# EAGLE design snes_sd_cart (EAGLE 9.6.2)
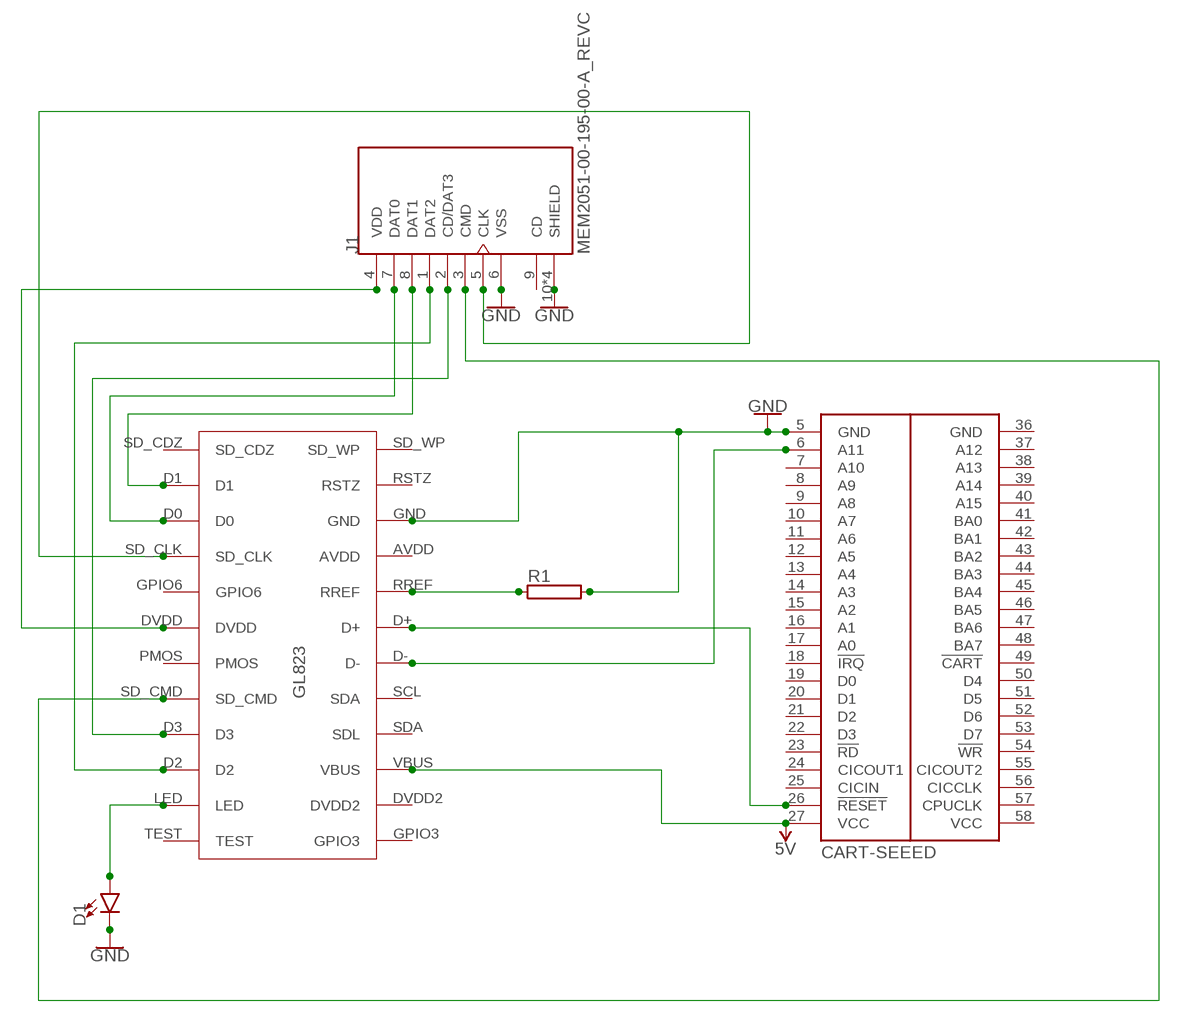
[diagram p0: schematic, sheet 1]

## Parts
D1  LED-3MM-NO_SILK  [LED_3MM-NS]
J1  MEM2051-00-195-00-A_REVC  [GCT_MEM2051-00-195-00-A_REVC]
R1  RAC01  [AC01]
U$1  CART-SEEED  [CART-50MM]
U$2  GL823  [GL823]

## Nets
5V: U$1.27(VCC) U$2.VBUS
GND: D1.K(C) J1.6(VSS) J1.10(SHIELD) J1.11(SHIELD) J1.12(SHIELD) J1.13(SHIELD) R1.2 U$1.5(GND) U$2.GND
N$1: J1.7(DAT0) U$2.D0
N$2: J1.8(DAT1) U$2.D1
N$3: J1.1(DAT2) U$2.D2
N$4: J1.2(CD/DAT3) U$2.D3
N$5: J1.3(CMD) U$2.SD_CMD
N$6: J1.5(CLK) U$2.SD_CLK
N$7: R1.1 U$2.RREF
N$8: J1.4(VDD) U$2.DVDD
N$9: U$1.26(!RESET) U$2.D+
N$10: U$1.6(A11) U$2.D-
N$11: D1.A U$2.LED
Unconnected: J1.9(CD) U$1.7(A10) U$1.8(A9) U$1.9(A8) U$1.10(A7) U$1.11(A6) U$1.12(A5) U$1.13(A4) U$1.14(A3) U$1.15(A2) U$1.16(A1) U$1.17(A0) U$1.18(!IRQ) U$1.19(D0) U$1.20(D1) U$1.21(D2) U$1.22(D3) U$1.23(!RD) U$1.24(CICOUT1) U$1.25(CICIN) U$1.37(A12) U$1.38(A13) U$1.39(A14) U$1.40(A15) U$1.41(BA0) U$1.42(BA1) U$1.43(BA2) U$1.44(BA3) U$1.45(BA4) U$1.46(BA5) U$1.47(BA6) U$1.48(BA7) U$1.49(!CART) U$1.50(D4) U$1.51(D5) U$1.52(D6) U$1.53(D7) U$1.54(!WR) U$1.55(CICOUT2) U$1.56(CICCLK) U$1.57(CPUCLK) U$2.AVDD U$2.DVDD2 U$2.GPIO3 U$2.GPIO6 U$2.PMOS U$2.RSTZ U$2.SCL(SDA) U$2.SD_CDZ U$2.SD_WP U$2.SDA(SDL) U$2.TEST

## Power pins joined to a net without a drawn wire
GND: U$1.36(GND)
VCC: U$1.58(VCC)

## Library data of the parts
D1 = SparkFun-LED:LED: LED (Generic) Standard schematic elements and footprints for 5mm, 3mm, 1206, and 0603 sized LEDs. Generic LEDs with no color specified.
J1 = MEM2051-00-195-00-A_REVC:MEM2051-00-195-00-A_REVC: Micro SD Memory Card Connector, 1.88mm Profile SMT,Push Push, with normally closed switch Check prices <https://snapeda.com/parts/MEM2051-00-195-00-A/Global%20Connector%20Technology/view-part/?ref=eda> Check prices <https://pricing.snapeda.com/parts/MEM2051-00-195-00-A/Global%20Connector%20Technology/view-part?ref=eda>; AVAILABILITY: Warning; DESCRIPTION: 9 (8 + 1) Position Card Connector microSD Surface Mount, Right Angle Gold, 1.95mm profile, Normally open switch, Push push, Top mount; MF: Global Connector Technology; MP: MEM2051-00-195-00-A; PACKAGE: None; PRICE: None
R1 = resistor-power:R: Power Resitor; OC_FARNELL: unknown; OC_NEWARK: unknown
U$1 = snes_cart:CART: Standard 46-contact SNES cartridge edge connector
U$2 = untitled:GL823

## Board
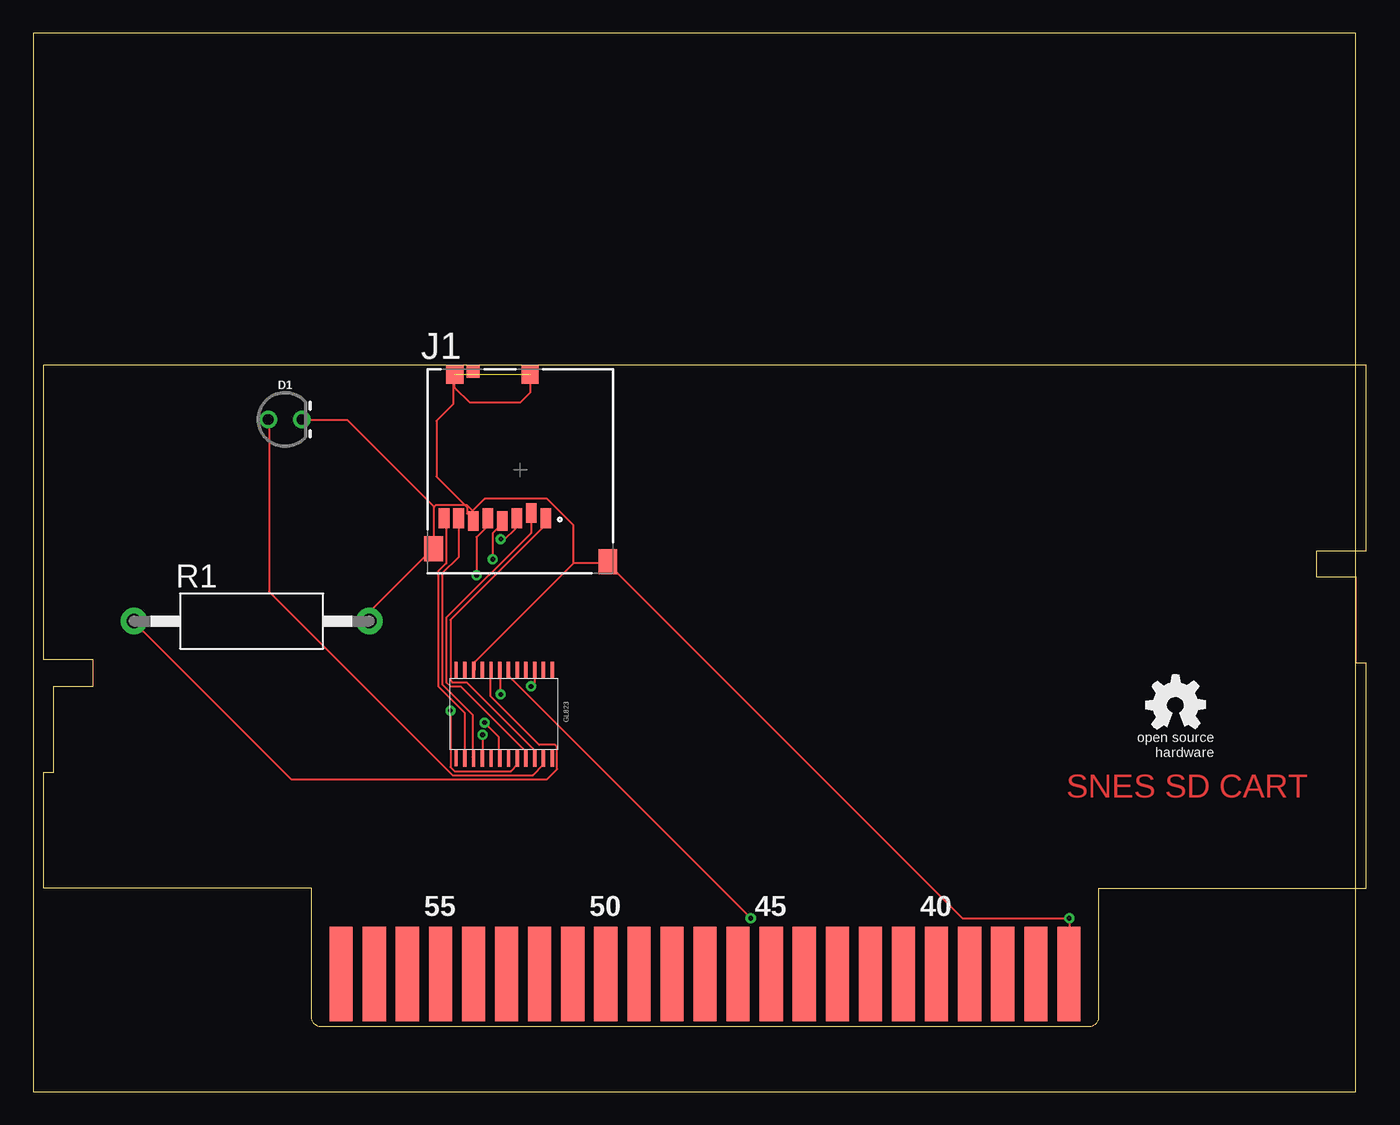
[diagram p1: board, top side]
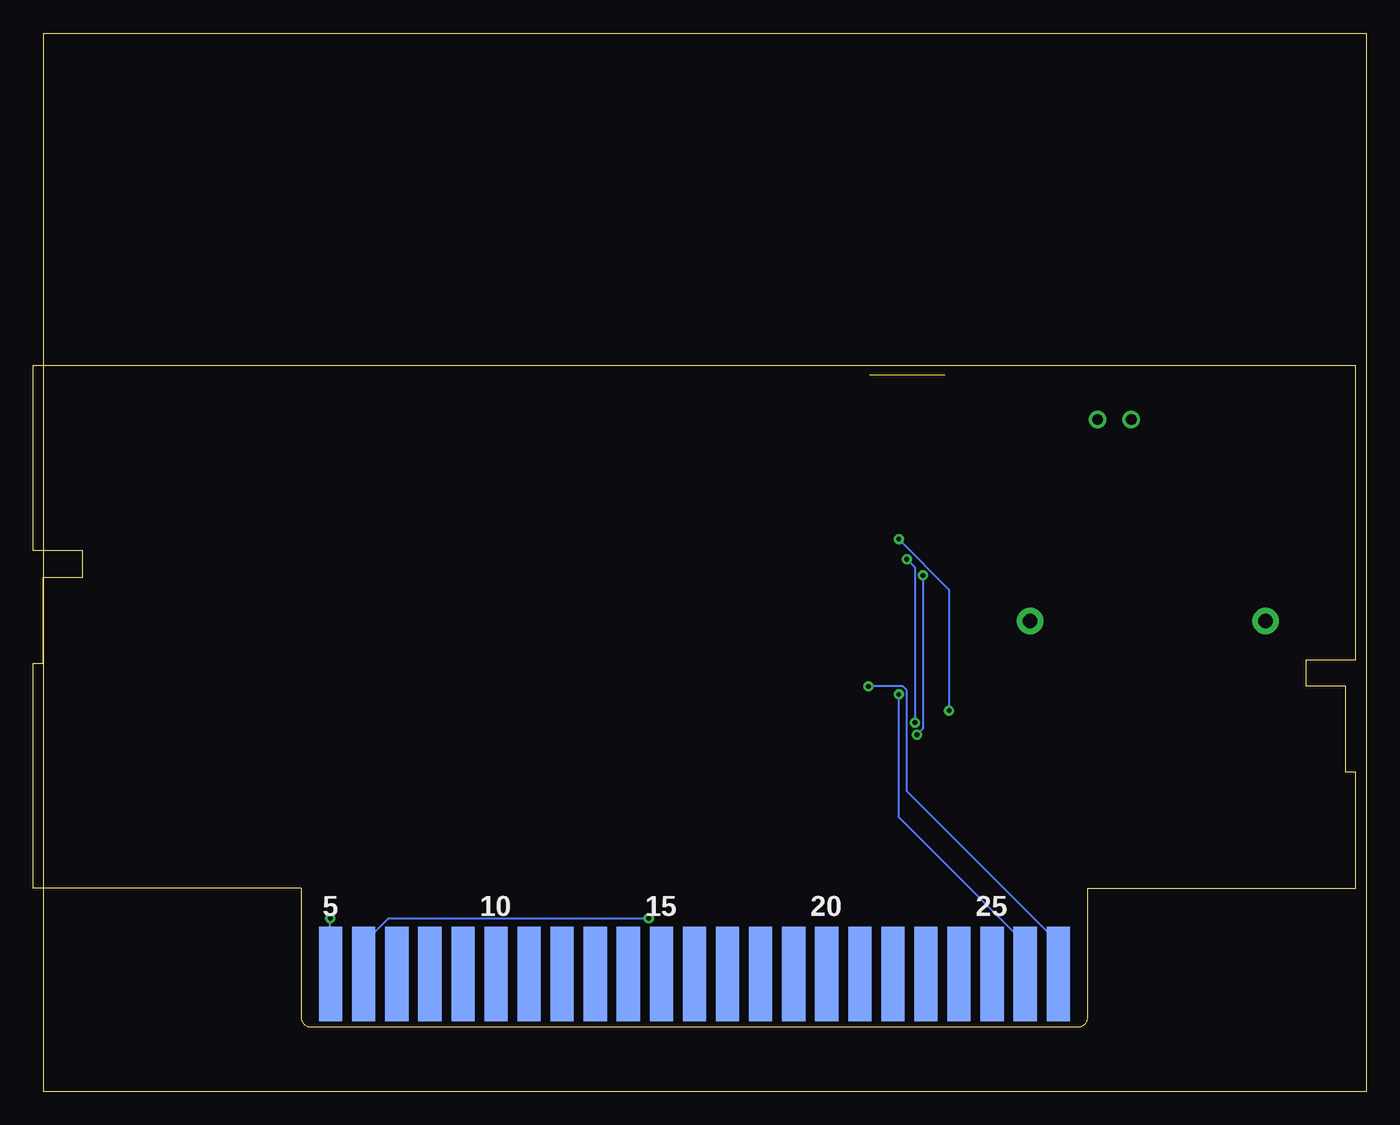
[diagram p2: board, bottom side, seen from below]

Size 100 x 80 mm. Coordinates in mm from the lower left corner, seen from the top.
Outline: 0,0 100,0 100,80 0,80 0,0
Copper layers (1*16): Top 0.035mm / dielectric 1.5mm / Bottom 0.035mm
Design rules "default": minimum track width 6mil, minimum drill 0.35mm, track to track 6mil, track to pad 6mil, pad to pad 6mil, via to via 6mil, smd to smd 6mil, copper to edge 40mil, drill to drill 6mil, minimum pad ring 10mil, minimum via ring 8mil, stop-mask expansion 4mil, vias tented up to drill 0mil, thermal gap 10mil

### Footprints (pad centres in the part's own frame; a part is rotated, then mirrored left to right if it is on the bottom)
LED_3MM-NS = drill 0.813: A -1.27,0; K 1.27,0
GCT_MEM2051-00-195-00-A_REVC = smd 0.8 x 1.5: 1 1.94,-3.66; 2 0.84,-3.26; 3 -0.26,-3.66; 4 -1.36,-3.86; 5 -2.46,-3.66; 6 -3.56,-3.86; 7 -4.66,-3.66; 8 -5.76,-3.66 | smd 1 x 0.95: 9 -3.56,7.425 | smd 1.3 x 1.4: 10 -4.95,7.2; 11 0.75,7.2 | smd 1.4 x 1.9: 12 -6.55,-5.95; 13 6.6,-6.95
AC01 = drill 1.1 pad 2: 1 -8.9,0; 2 8.9,0
CART-50MM = smd 1.75 x 7.15 bottom: 5 27.5,0; 6 25,0; 7 22.5,0; 8 20,0; 9 17.5,0; 10 15,0; 11 12.5,0; 12 10,0; 13 7.5,0; 14 5,0; 15 2.5,0; 16 0,0; 17 -2.5,0; 18 -5,0; 19 -7.5,0; 20 -10,0; 21 -12.5,0; 22 -15,0; 23 -17.5,0; 24 -20,0; 25 -22.5,0; 26 -25,0; 27 -27.5,0 | smd 1.75 x 7.15: 36 27.5,0; 37 25,0; 38 22.5,0; 39 20,0; 40 17.5,0; 41 15,0; 42 12.5,0; 43 10,0; 44 7.5,0; 45 5,0; 46 2.5,0; 47 0,0; 48 -2.5,0; 49 -5,0; 50 -7.5,0; 51 -10,0; 52 -12.5,0; 53 -15,0; 54 -17.5,0; 55 -20,0; 56 -22.5,0; 57 -25,0; 58 -27.5,0
GL823 = smd 0.254 x 1.245: AVDD -1.6,2.642; D0 -2.261,-3.988; D1 -2.921,-3.988; D2 2.362,-3.988; D3 1.702,-3.988; D+ -0.279,2.642; D- 0.381,2.642; DVDD -0.279,-3.988; DVDD2 3.023,2.642; GND -2.261,2.642; GPIO3 3.683,2.642; GPIO6 -0.94,-3.988; LED 3.023,-3.988; PMOS 0.381,-3.988; RREF -0.94,2.642; RSTZ -2.921,2.642; SCL 1.702,2.642; SD_CDZ -3.581,-3.988; SD_CLK -1.6,-3.988; SD_CMD 1.041,-3.988; SD_WP -3.581,2.642; SDA 1.041,2.642; TEST 3.683,-3.988; VBUS 2.362,2.642

### Placement (x,y rotation side)
D1  19.05,50.8 0 top
E$1  [OSHW_5MM]  86.36,29.21 0 top
J1  36.83,46.99 0 top
R1  16.51,35.56 0 top
U$1  50.8,8.89 0 top
U$2  35.56,29.21 0 top

### Tracks (layer width: path | path; a pad name or v marks a point on that pad's centre or on a via)
5V  (via drill 0.35)
  Top 0.152: v37.64,30.63 37.95,30.94 37.95,31.85 U$2.VBUS
  Bottom 0.152: v37.64,30.63 35.05,30.63 34.75,30.33 34.75,22.71 23.32,11.28 23.32,8.99 U$1.27
GND  (via drill 0.35)  (1 unrouted)
  Top 0.152: 33.22,43.89 33.22,43.28 | 33.22,43.89 32.77,44.35 30.48,44.35 30.33,44.2 | 30.33,44.2 30.33,41.15 J1.12 30.18,41 25.45,36.27 25.45,35.66 R1.2 | 33.22,43.28 J1.6 | 30.33,44.2 23.77,50.75 20.42,50.75 D1.K | U$1.5 78.33,8.99 v78.33,13.11 70.26,13.11 43.43,39.93 J1.13 43.28,39.93 40.84,39.93 | 40.84,39.93 33.38,32.46 33.38,31.85 U$2.GND | 33.22,43.89 34.14,44.81 38.86,44.81 40.84,42.82 40.84,39.93 | J1.11 37.58,52.82 36.83,52.07 33.02,52.07 31.88,53.21 31.88,53.8 31.75,53.8 31.75,51.95 30.5,50.69 30.5,46.48 32.8,44.17 32.8,43.71 33.22,43.28
  Bottom 0.152: v78.33,13.11 78.33,8.99 U$1.5
N$1
  Top 0.152: U$2.D0 33.22,25.3 33.22,28.5 30.94,30.79 30.94,39.17 32.16,40.39 32.16,43.28 J1.7
N$2
  Top 0.152: U$2.D1 32.61,25.3 32.61,28.65 30.63,30.63 30.63,39.32 31.24,39.93 31.24,43.13 31.09,43.28 J1.8
N$3
  Top 0.152: U$2.D2 37.95,25.3 37.95,25.76 32.77,30.94 31.7,30.94 31.55,31.09 31.55,35.66 38.71,42.82 38.71,43.28 J1.1
N$4
  Top 0.152: U$2.D3 37.19,25.3 37.19,25.76 32.31,30.63 31.55,30.63 31.24,30.94 31.24,35.81 37.64,42.22 37.64,43.59 J1.2
N$5  (via drill 0.35)
  Top 0.152: v31.55,28.8 31.55,24.54 31.85,24.23 36.12,24.23 36.58,24.69 36.58,25.15 U$2.SD_CMD | v35.36,41.76 35.66,41.76 36.42,42.52 36.42,43.28 J1.3
  Bottom 0.152: v31.55,28.8 31.55,37.95 v35.36,41.76
N$6  (via drill 0.35)
  Top 0.152: v33.98,26.98 33.98,25.3 U$2.SD_CLK | v33.53,39.01 33.53,41.91 34.29,42.67 34.29,43.28 J1.5
  Bottom 0.152: v33.98,26.98 33.53,27.43 v33.53,39.01
N$7
  Top 0.152: U$2.RREF 34.59,31.85 34.59,29.87 38.25,26.21 39.47,26.21 39.62,26.06 39.62,24.38 38.86,23.62 19.51,23.62 7.62,35.51 R1.1
N$8  (via drill 0.35)
  Top 0.152: v34.14,27.89 35.2,26.82 35.2,25.3 U$2.DVDD | v34.75,40.23 34.75,42.22 35.36,42.82 35.36,43.13 J1.4
  Bottom 0.152: v34.14,27.89 34.14,39.62 v34.75,40.23
N$9  (via drill 0.35)
  Top 0.152: v35.36,30.02 35.36,31.85 U$2.D+
  Bottom 0.152: v35.36,30.02 35.36,20.73 25.91,11.28 25.91,8.99 U$1.26
N$10  (via drill 0.35)
  Top 0.152: v54.25,13.11 35.97,31.39 35.97,31.85 U$2.D-
  Bottom 0.152: v54.25,13.11 73.91,13.11 75.74,11.28 75.74,8.99 U$1.6
N$11
  Top 0.152: U$2.LED 38.56,25.15 38.56,24.69 37.8,23.93 31.7,23.93 17.83,37.8 17.83,50.75 D1.A

### Text on the board
Top: SNES SD CART